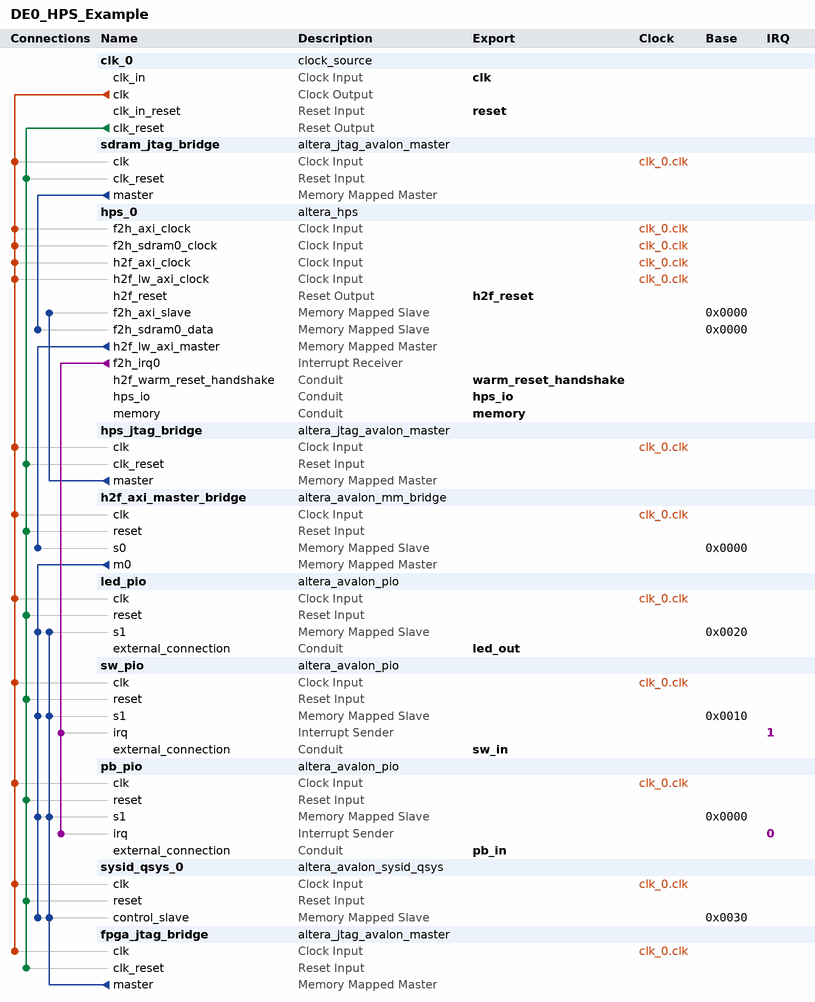
[diagram p0: system contents]
# Platform Designer (Qsys) system DE0_HPS_Example, Cyclone V 5CSEMA4U23C6
# Parameters at their usual value, and those the tool derives, are not listed.
package require -exact qsys 18.1
create_system DE0_HPS_Example
set_project_property DEVICE_FAMILY {Cyclone V}
set_project_property DEVICE 5CSEMA4U23C6

add_instance clk_0 clock_source 18.1
set_instance_parameter_value clk_0 clockFrequency 50000000

add_instance sdram_jtag_bridge altera_jtag_avalon_master 18.1

add_instance hps_0 altera_hps 18.1
set_instance_parameter_value hps_0 EMAC1_Mode RGMII
set_instance_parameter_value hps_0 EMAC1_PinMuxing {HPS I/O Set 0}
set_instance_parameter_value hps_0 F2SCLK_COLDRST_Enable false
set_instance_parameter_value hps_0 F2SCLK_DBGRST_Enable false
set_instance_parameter_value hps_0 F2SCLK_WARMRST_Enable false
set_instance_parameter_value hps_0 F2SDRAM_Type {Avalon-MM Bidirectional}
set_instance_parameter_value hps_0 F2SDRAM_Width 256
set_instance_parameter_value hps_0 F2SINTERRUPT_Enable true
set_instance_parameter_value hps_0 F2S_Width 1
set_instance_parameter_value hps_0 FPGA_PERIPHERAL_OUTPUT_CLOCK_FREQ_EMAC0_GTX_CLK 125
set_instance_parameter_value hps_0 FPGA_PERIPHERAL_OUTPUT_CLOCK_FREQ_EMAC0_MD_CLK 2.5
set_instance_parameter_value hps_0 FPGA_PERIPHERAL_OUTPUT_CLOCK_FREQ_EMAC1_GTX_CLK 125
set_instance_parameter_value hps_0 FPGA_PERIPHERAL_OUTPUT_CLOCK_FREQ_EMAC1_MD_CLK 2.5
set_instance_parameter_value hps_0 HPS_PROTOCOL DDR3
set_instance_parameter_value hps_0 I2C0_Mode I2C
set_instance_parameter_value hps_0 I2C0_PinMuxing {HPS I/O Set 0}
set_instance_parameter_value hps_0 I2C1_Mode I2C
set_instance_parameter_value hps_0 I2C1_PinMuxing {HPS I/O Set 0}
set_instance_parameter_value hps_0 LWH2F_Enable true
set_instance_parameter_value hps_0 MEM_BANKADDR_WIDTH 3
set_instance_parameter_value hps_0 MEM_CLK_FREQ 400.0
set_instance_parameter_value hps_0 MEM_COL_ADDR_WIDTH 10
set_instance_parameter_value hps_0 MEM_DQ_WIDTH 32
set_instance_parameter_value hps_0 MEM_DRV_STR RZQ/6
set_instance_parameter_value hps_0 MEM_ROW_ADDR_WIDTH 15
set_instance_parameter_value hps_0 MEM_RTT_NOM RZQ/6
set_instance_parameter_value hps_0 MEM_RTT_WR {Dynamic ODT off}
set_instance_parameter_value hps_0 MEM_TCL 7
set_instance_parameter_value hps_0 MEM_TFAW_NS 30.0
set_instance_parameter_value hps_0 MEM_TRAS_NS 35.0
set_instance_parameter_value hps_0 MEM_TRCD_NS 13.75
set_instance_parameter_value hps_0 MEM_TRFC_NS 260.0
set_instance_parameter_value hps_0 MEM_TRP_NS 13.75
set_instance_parameter_value hps_0 MEM_TRRD_NS 10.0
set_instance_parameter_value hps_0 MEM_TRTP_NS 10.0
set_instance_parameter_value hps_0 MEM_VENDOR JEDEC
set_instance_parameter_value hps_0 MEM_WTCL 6
set_instance_parameter_value hps_0 QSPI_Mode N/A
set_instance_parameter_value hps_0 QSPI_PinMuxing Unused
set_instance_parameter_value hps_0 REF_CLK_FREQ 25.0
set_instance_parameter_value hps_0 S2FCLK_PENDINGRST_Enable true
set_instance_parameter_value hps_0 S2FCLK_USER2CLK 5
set_instance_parameter_value hps_0 S2F_Width 1
set_instance_parameter_value hps_0 SDIO_Mode {4-bit Data}
set_instance_parameter_value hps_0 SDIO_PinMuxing {HPS I/O Set 0}
set_instance_parameter_value hps_0 SPIM1_Mode {Single Slave Select}
set_instance_parameter_value hps_0 SPIM1_PinMuxing {HPS I/O Set 0}
set_instance_parameter_value hps_0 STM_Enable false
set_instance_parameter_value hps_0 TIMING_BOARD_AC_SKEW 0.03
set_instance_parameter_value hps_0 TIMING_BOARD_AC_TO_CK_SKEW 0.0
set_instance_parameter_value hps_0 TIMING_BOARD_DQ_TO_DQS_SKEW 0.0
set_instance_parameter_value hps_0 TIMING_BOARD_MAX_CK_DELAY 0.03
set_instance_parameter_value hps_0 TIMING_BOARD_MAX_DQS_DELAY 0.02
set_instance_parameter_value hps_0 TIMING_BOARD_SKEW_BETWEEN_DQS 0.08
set_instance_parameter_value hps_0 TIMING_BOARD_SKEW_CKDQS_DIMM_MAX 0.16
set_instance_parameter_value hps_0 TIMING_BOARD_SKEW_CKDQS_DIMM_MIN 0.09
set_instance_parameter_value hps_0 TIMING_BOARD_SKEW_WITHIN_DQS 0.01
set_instance_parameter_value hps_0 TIMING_TDH 65
set_instance_parameter_value hps_0 TIMING_TDQSCK 255
set_instance_parameter_value hps_0 TIMING_TDQSQ 125
set_instance_parameter_value hps_0 TIMING_TDS 30
set_instance_parameter_value hps_0 TIMING_TIH 140
set_instance_parameter_value hps_0 TIMING_TIS 180
set_instance_parameter_value hps_0 TIMING_TQSH 0.4
set_instance_parameter_value hps_0 UART0_Mode {No Flow Control}
set_instance_parameter_value hps_0 UART0_PinMuxing {HPS I/O Set 0}
set_instance_parameter_value hps_0 USB1_Mode SDR
set_instance_parameter_value hps_0 USB1_PinMuxing {HPS I/O Set 0}
set_instance_parameter_value hps_0 desired_cfg_clk_mhz 123.333333333333
set_instance_parameter_value hps_0 desired_qspi_clk_mhz 370.0

add_instance hps_jtag_bridge altera_jtag_avalon_master 18.1

add_instance h2f_axi_master_bridge altera_avalon_mm_bridge 18.1
set_instance_parameter_value h2f_axi_master_bridge ADDRESS_UNITS SYMBOLS
set_instance_parameter_value h2f_axi_master_bridge ADDRESS_WIDTH 10
set_instance_parameter_value h2f_axi_master_bridge DATA_WIDTH 32
set_instance_parameter_value h2f_axi_master_bridge MAX_PENDING_RESPONSES 4
set_instance_parameter_value h2f_axi_master_bridge USE_AUTO_ADDRESS_WIDTH 0

add_instance led_pio altera_avalon_pio 18.1
set_instance_parameter_value led_pio direction Output
set_instance_parameter_value led_pio width 8

add_instance sw_pio altera_avalon_pio 18.1
set_instance_parameter_value sw_pio bitClearingEdgeCapReg true
set_instance_parameter_value sw_pio captureEdge true
set_instance_parameter_value sw_pio direction Input
set_instance_parameter_value sw_pio edgeType ANY
set_instance_parameter_value sw_pio generateIRQ true
set_instance_parameter_value sw_pio irqType EDGE
set_instance_parameter_value sw_pio width 4

add_instance pb_pio altera_avalon_pio 18.1
set_instance_parameter_value pb_pio bitClearingEdgeCapReg true
set_instance_parameter_value pb_pio captureEdge true
set_instance_parameter_value pb_pio direction Input
set_instance_parameter_value pb_pio edgeType ANY
set_instance_parameter_value pb_pio generateIRQ true
set_instance_parameter_value pb_pio irqType EDGE
set_instance_parameter_value pb_pio width 2

add_instance sysid_qsys_0 altera_avalon_sysid_qsys 18.1
set_instance_parameter_value sysid_qsys_0 id 1193046

add_instance fpga_jtag_bridge altera_jtag_avalon_master 18.1

# connections
add_connection clk_0.clk fpga_jtag_bridge.clk clock
add_connection clk_0.clk h2f_axi_master_bridge.clk clock
add_connection clk_0.clk hps_0.f2h_axi_clock clock
add_connection clk_0.clk hps_0.f2h_sdram0_clock clock
add_connection clk_0.clk hps_0.h2f_axi_clock clock
add_connection clk_0.clk hps_0.h2f_lw_axi_clock clock
add_connection clk_0.clk hps_jtag_bridge.clk clock
add_connection clk_0.clk led_pio.clk clock
add_connection clk_0.clk pb_pio.clk clock
add_connection clk_0.clk sdram_jtag_bridge.clk clock
add_connection clk_0.clk sw_pio.clk clock
add_connection clk_0.clk sysid_qsys_0.clk clock
add_connection clk_0.clk_reset fpga_jtag_bridge.clk_reset reset
add_connection clk_0.clk_reset h2f_axi_master_bridge.reset reset
add_connection clk_0.clk_reset hps_jtag_bridge.clk_reset reset
add_connection clk_0.clk_reset led_pio.reset reset
add_connection clk_0.clk_reset pb_pio.reset reset
add_connection clk_0.clk_reset sdram_jtag_bridge.clk_reset reset
add_connection clk_0.clk_reset sw_pio.reset reset
add_connection clk_0.clk_reset sysid_qsys_0.reset reset
add_connection fpga_jtag_bridge.master led_pio.s1 avalon
set_connection_parameter_value fpga_jtag_bridge.master/led_pio.s1 baseAddress 0x0020
add_connection fpga_jtag_bridge.master pb_pio.s1 avalon
set_connection_parameter_value fpga_jtag_bridge.master/pb_pio.s1 baseAddress 0x0000
add_connection fpga_jtag_bridge.master sw_pio.s1 avalon
set_connection_parameter_value fpga_jtag_bridge.master/sw_pio.s1 baseAddress 0x0010
add_connection fpga_jtag_bridge.master sysid_qsys_0.control_slave avalon
set_connection_parameter_value fpga_jtag_bridge.master/sysid_qsys_0.control_slave baseAddress 0x0030
add_connection h2f_axi_master_bridge.m0 led_pio.s1 avalon
set_connection_parameter_value h2f_axi_master_bridge.m0/led_pio.s1 baseAddress 0x0020
add_connection h2f_axi_master_bridge.m0 pb_pio.s1 avalon
set_connection_parameter_value h2f_axi_master_bridge.m0/pb_pio.s1 baseAddress 0x0000
add_connection h2f_axi_master_bridge.m0 sw_pio.s1 avalon
set_connection_parameter_value h2f_axi_master_bridge.m0/sw_pio.s1 baseAddress 0x0010
add_connection h2f_axi_master_bridge.m0 sysid_qsys_0.control_slave avalon
set_connection_parameter_value h2f_axi_master_bridge.m0/sysid_qsys_0.control_slave baseAddress 0x0030
add_connection hps_0.h2f_lw_axi_master h2f_axi_master_bridge.s0 avalon
set_connection_parameter_value hps_0.h2f_lw_axi_master/h2f_axi_master_bridge.s0 baseAddress 0x0000
add_connection hps_jtag_bridge.master hps_0.f2h_axi_slave avalon
set_connection_parameter_value hps_jtag_bridge.master/hps_0.f2h_axi_slave baseAddress 0x0000
add_connection sdram_jtag_bridge.master hps_0.f2h_sdram0_data avalon
set_connection_parameter_value sdram_jtag_bridge.master/hps_0.f2h_sdram0_data baseAddress 0x0000
add_connection hps_0.f2h_irq0 pb_pio.irq interrupt
set_connection_parameter_value hps_0.f2h_irq0/pb_pio.irq irqNumber 0
add_connection hps_0.f2h_irq0 sw_pio.irq interrupt
set_connection_parameter_value hps_0.f2h_irq0/sw_pio.irq irqNumber 1

# exported interfaces
add_interface clk clock sink
set_interface_property clk EXPORT_OF clk_0.clk_in
add_interface h2f_reset reset source
set_interface_property h2f_reset EXPORT_OF hps_0.h2f_reset
add_interface hps_io conduit end
set_interface_property hps_io EXPORT_OF hps_0.hps_io
add_interface led_out conduit end
set_interface_property led_out EXPORT_OF led_pio.external_connection
add_interface memory conduit end
set_interface_property memory EXPORT_OF hps_0.memory
add_interface pb_in conduit end
set_interface_property pb_in EXPORT_OF pb_pio.external_connection
add_interface reset reset sink
set_interface_property reset EXPORT_OF clk_0.clk_in_reset
add_interface sw_in conduit end
set_interface_property sw_in EXPORT_OF sw_pio.external_connection
add_interface warm_reset_handshake conduit end
set_interface_property warm_reset_handshake EXPORT_OF hps_0.h2f_warm_reset_handshake

set_interconnect_requirement {$system} qsys_mm.clockCrossingAdapter HANDSHAKE
set_interconnect_requirement {$system} qsys_mm.enableEccProtection FALSE
set_interconnect_requirement {$system} qsys_mm.insertDefaultSlave FALSE
set_interconnect_requirement {$system} qsys_mm.maxAdditionalLatency 1

save_system DE0_HPS_Example.qsys
